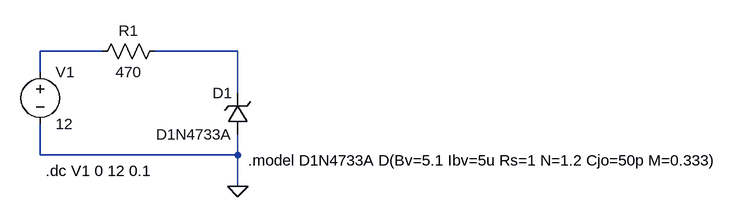
[diagram p0: schematic zener diode.asc]
zener diode.asc, the LTspice schematic file:
Version 4.1
SHEET 1 1152 680
WIRE 128 112 32 112
WIRE 336 112 208 112
WIRE 32 144 32 112
WIRE 336 176 336 112
WIRE 32 272 32 224
WIRE 336 272 336 240
WIRE 336 272 32 272
WIRE 336 320 336 272
FLAG 336 320 0
SYMBOL voltage 32 128 R0
SYMATTR InstName V1
SYMATTR Value 12
SYMBOL res 224 96 R90
WINDOW 0 0 56 VBottom 2
WINDOW 3 32 56 VTop 2
SYMATTR InstName R1
SYMATTR Value 470
SYMBOL zener 352 240 R180
WINDOW 0 24 64 Left 2
WINDOW 3 24 0 Left 2
SYMATTR InstName D1
SYMATTR Value D1N4733A
TEXT 352 280 Left 2 !.model D1N4733A D(Bv=5.1 Ibv=5u Rs=1 N=1.2 Cjo=50p M=0.333)
TEXT 40 296 Left 2 !.dc V1 0 12 0.1

The netlist it stands for:
* zener diode.asc
V1 N001 0 12
R1 N002 N001 470
D1 0 N002 D1N4733A
.model D D
.lib standard.dio
.model D1N4733A D(Bv=5.1 Ibv=5u Rs=1 N=1.2 Cjo=50p M=0.333)
.dc V1 0 12 0.1
.backanno
.end